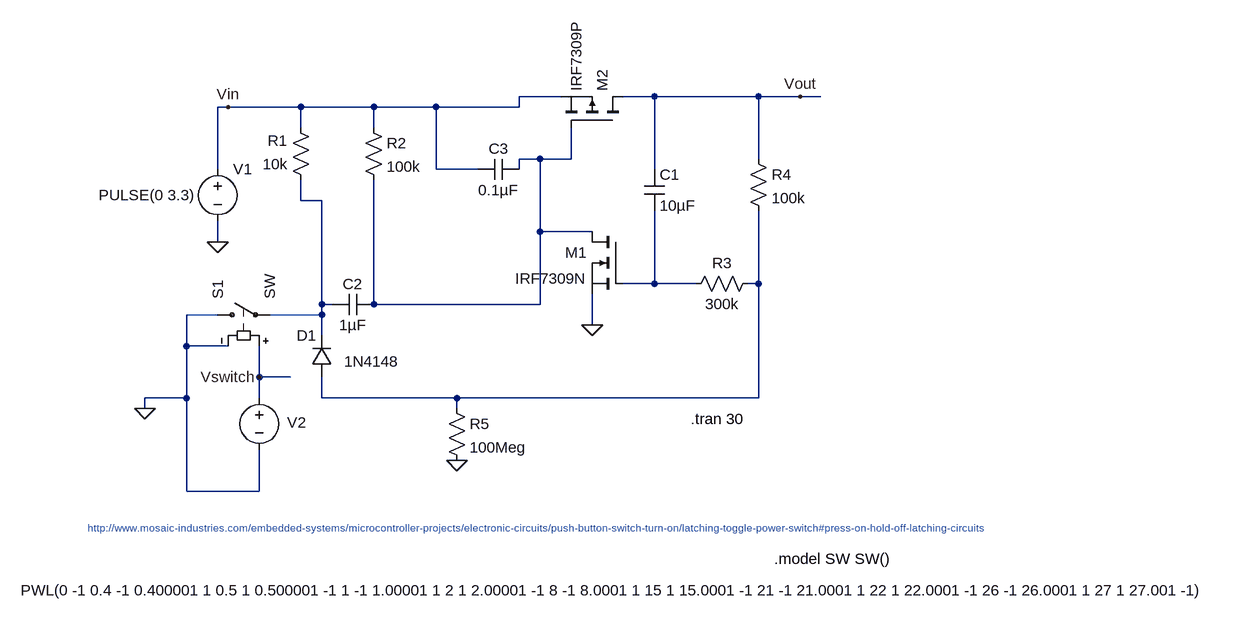
[diagram p0: schematic push-on-hold-off.asc]
push-on-hold-off.asc, the LTspice schematic file:
Version 4
SHEET 1 2288 904
WIRE 320 80 256 80
WIRE 464 80 416 80
WIRE 624 80 464 80
WIRE 688 80 624 80
WIRE 720 80 688 80
WIRE -192 96 -208 96
WIRE -80 96 -192 96
WIRE 32 96 -80 96
WIRE 128 96 32 96
WIRE 256 96 256 80
WIRE 256 96 128 96
WIRE -80 128 -80 96
WIRE 32 128 32 96
WIRE 288 176 256 176
WIRE 336 176 336 128
WIRE 336 176 288 176
WIRE 624 176 624 80
WIRE -208 192 -208 96
WIRE 128 192 128 96
WIRE 192 192 128 192
WIRE 256 192 256 176
WIRE 464 192 464 80
WIRE -80 240 -80 208
WIRE -48 240 -80 240
WIRE 288 288 288 176
WIRE 368 288 288 288
WIRE -208 304 -208 272
WIRE 464 368 464 256
WIRE 464 368 416 368
WIRE 528 368 464 368
WIRE 624 368 624 256
WIRE 624 368 608 368
WIRE -48 400 -48 240
WIRE -32 400 -48 400
WIRE 32 400 32 208
WIRE 288 400 288 288
WIRE 288 400 32 400
WIRE -208 416 -256 416
WIRE -48 416 -48 400
WIRE -48 416 -128 416
WIRE 368 432 368 384
WIRE -48 448 -48 416
WIRE -256 464 -256 416
WIRE -192 464 -256 464
WIRE -144 512 -144 464
WIRE -96 512 -144 512
WIRE -256 544 -256 464
WIRE -256 544 -320 544
WIRE -144 544 -144 512
WIRE -48 544 -48 512
WIRE 160 544 -48 544
WIRE 624 544 624 368
WIRE 624 544 160 544
WIRE -320 560 -320 544
WIRE 160 560 160 544
WIRE -256 688 -256 544
WIRE -144 688 -144 624
WIRE -144 688 -256 688
FLAG -208 304 0
FLAG 368 432 0
FLAG 688 80 Vout
FLAG -320 560 0
FLAG -192 96 Vin
FLAG 160 640 0
FLAG -144 512 Vswitch
SYMBOL res -64 224 R180
WINDOW 0 36 76 Left 2
WINDOW 3 36 40 Left 2
SYMATTR InstName R1
SYMATTR Value 10k
SYMBOL res 16 112 R0
SYMATTR InstName R2
SYMATTR Value 100k
SYMBOL diode -32 512 R180
WINDOW 0 24 64 Left 2
WINDOW 3 -103 24 Left 2
SYMATTR InstName D1
SYMATTR Value 1N4148
SYMBOL nmos 416 288 M0
SYMATTR InstName M1
SYMATTR Value IRF7309N
SYMBOL pmos 416 128 M270
SYMATTR InstName M2
SYMATTR Value IRF7309P
SYMBOL cap 448 192 R0
SYMATTR InstName C1
SYMATTR Value 10µF
SYMBOL cap 32 384 R90
WINDOW 0 0 32 VBottom 2
WINDOW 3 32 32 VTop 2
SYMATTR InstName C2
SYMATTR Value 1µF
SYMBOL res 624 352 R90
WINDOW 0 0 56 VBottom 2
WINDOW 3 32 56 VTop 2
SYMATTR InstName R3
SYMATTR Value 300k
SYMBOL res 608 160 R0
SYMATTR InstName R4
SYMATTR Value 100k
SYMBOL cap 256 176 R90
WINDOW 0 0 32 VBottom 2
WINDOW 3 32 32 VTop 2
SYMATTR InstName C3
SYMATTR Value 0.1µF
SYMBOL voltage -144 528 R0
WINDOW 123 0 0 Left 2
WINDOW 39 0 0 Left 2
WINDOW 3 -367 312 Left 2
WINDOW 0 43 54 Left 2
SYMATTR Value PWL(0 -1 0.4 -1 0.400001 1 0.5 1 0.500001 -1 1 -1 1.00001 1 2 1 2.00001 -1 8 -1 8.0001 1 15 1 15.0001 -1 21 -1 21.0001 1 22 1 22.0001 -1 26 -1 26.0001 1 27 1 27.001 -1)
SYMATTR InstName V2
SYMBOL sw -224 416 R270
SYMATTR InstName S1
SYMBOL voltage -208 176 R0
WINDOW 3 -183 56 Left 2
WINDOW 123 0 0 Left 2
WINDOW 39 0 0 Left 2
SYMATTR Value PULSE(0 3.3)
SYMATTR InstName V1
SYMBOL res 144 544 R0
SYMATTR InstName R5
SYMATTR Value 100Meg
TEXT 520 576 Left 2 !.tran 30
TEXT -408 744 Left 1 ;http://www.mosaic-industries.com/embedded-systems/microcontroller-projects/electronic-circuits/push-button-switch-turn-on/latching-toggle-power-switch#press-on-hold-off-latching-circuits
TEXT 648 792 Left 2 !.model SW SW()

The netlist it stands for:
* push-on-hold-off.asc
R1 N002 Vin 10k
R2 Vin N001 100k
D1 N004 N002 1N4148
M1 N001 N003 0 0 IRF7309N
M2 Vout N001 Vin Vin IRF7309P
C1 Vout N003 10µF
C2 N001 N002 1µF
R3 N004 N003 300k
R4 Vout N004 100k
C3 N001 Vin 0.1µF
V2 Vswitch 0 PWL(0 -1 0.4 -1 0.400001 1 0.5 1 0.500001 -1 1 -1 1.00001 1 2 1 2.00001 -1 8 -1 8.0001 1 15 1 15.0001 -1 21 -1 21.0001 1 22 1 22.0001 -1 26 -1 26.0001 1 27 1 27.001 -1)
S1 0 N002 Vswitch 0 SW
V1 Vin 0 PULSE(0 3.3)
R5 N004 0 100Meg
.model D D
.lib standard.dio
.model NMOS NMOS
.model PMOS PMOS
.lib standard.mos
.tran 30
* http://www.mosaic-industries.com/embedded-systems/microcontroller-projects/electronic-circuits/push-button-switch-turn-on/latching-toggle-power-switch#press-on-hold-off-latching-circuits
.model SW SW()
.backanno
.end